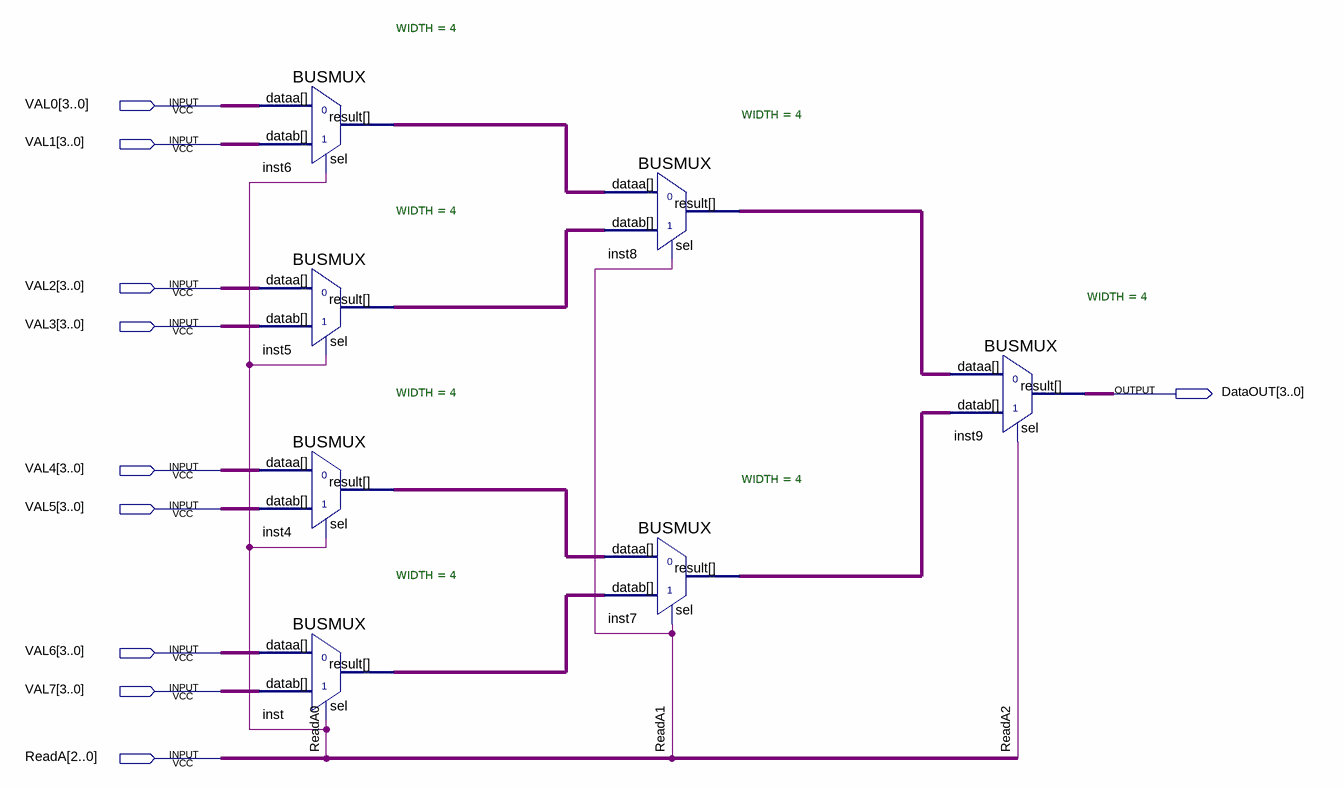
[diagram p0: schematic sheet]
// Quartus schematic mux8to1.bdf as structural Verilog: 7 symbols, 10 pins
module mux8to1 (
  input  [3:0] VAL0,
  input  [3:0] VAL1,
  input  [3:0] VAL2,
  input  [3:0] VAL3,
  input  [3:0] VAL4,
  input  [3:0] VAL5,
  input  [3:0] VAL6,
  input  [3:0] VAL7,
  input  [2:0] ReadA,
  output [3:0] DataOUT
);

  wire [3:0] inst4_result, inst5_result, inst6_result, inst7_result, inst8_result, inst_result;

  BUSMUX #(.WIDTH(4)) inst6 (.datab(VAL1), .sel(ReadA[0]), .dataa(VAL0), .result(inst6_result));
  BUSMUX #(.WIDTH(4)) inst5 (.datab(VAL3), .sel(ReadA[0]), .dataa(VAL2), .result(inst5_result));
  BUSMUX #(.WIDTH(4)) inst4 (.datab(VAL5), .sel(ReadA[0]), .dataa(VAL4), .result(inst4_result));
  BUSMUX #(.WIDTH(4)) inst (.datab(VAL7), .sel(ReadA[0]), .dataa(VAL6), .result(inst_result));
  BUSMUX #(.WIDTH(4)) inst8 (.datab(inst5_result), .sel(ReadA[1]), .dataa(inst6_result), .result(inst8_result));
  BUSMUX #(.WIDTH(4)) inst7 (.datab(inst_result), .sel(ReadA[1]), .dataa(inst4_result), .result(inst7_result));
  BUSMUX #(.WIDTH(4)) inst9 (.datab(inst7_result), .sel(ReadA[2]), .dataa(inst8_result), .result(DataOUT));
endmodule
